# EAGLE schematic epapertagjig (EAGLE 9.6.2)

## Sheet 1 of 2
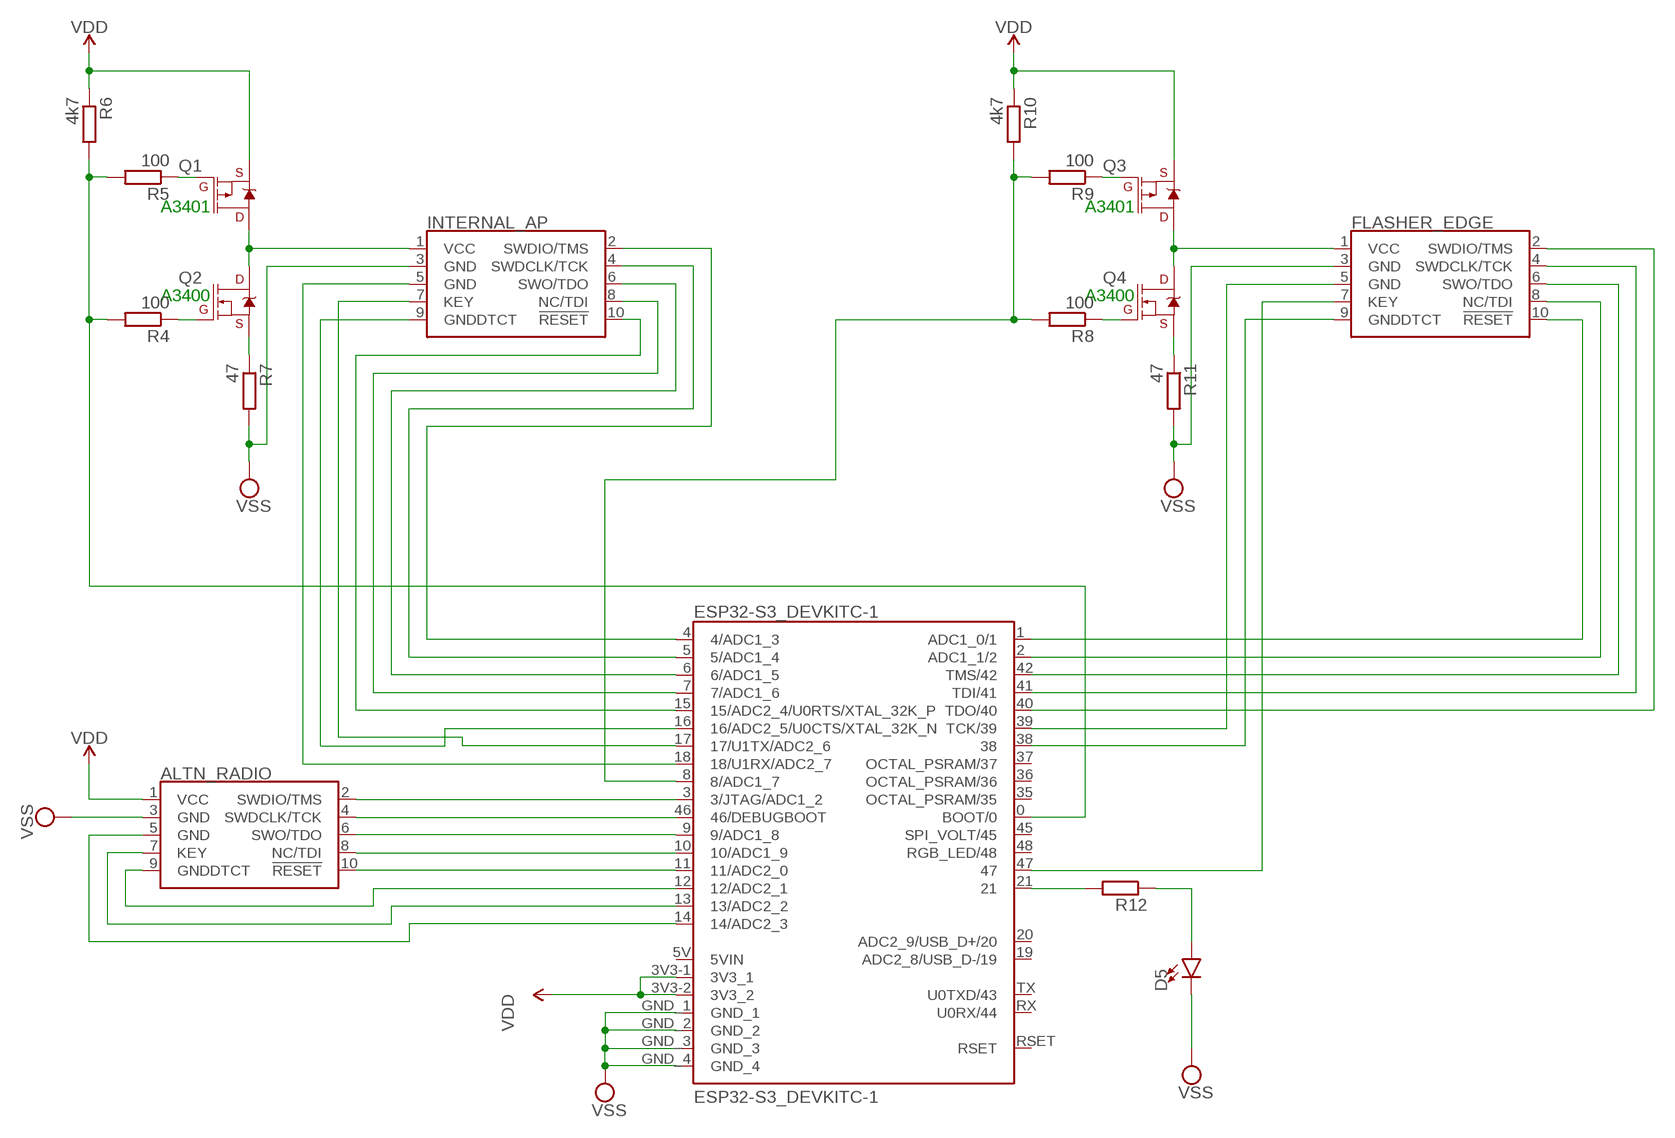
[diagram p0: schematic, sheet 1]

### Parts
ALTN_RADIO  JTAG  CORTEX_JTAG_DEBUG_SMD  [2X5-SMD-1.27MM]
D5  LED1206  [LED-1206]
FLASHER_EDGE  CORTEX_JTAG_DEBUG_PTH  [2X5-PTH-1.27MM]
INTERNAL_AP  JTAG  CORTEX_JTAG_DEBUG_SMD  [2X5-SMD-1.27MM]
J9  ESP32-S3_DEVKITC-1  [ESP32-S3_DEVKITC-1]
Q1  1.1A/60V/600mΩ  MOSFET_PCH-SI2309DS  [SOT23-3]
Q2  5.8A/30V/35mΩ  MOSFET-NCH-AO3404A  [SOT23-3]
Q3  1.1A/60V/600mΩ  MOSFET_PCH-SI2309DS  [SOT23-3]
Q4  5.8A/30V/35mΩ  MOSFET-NCH-AO3404A  [SOT23-3]
R4  100  R-EU_R1206  [R1206]
R5  100  R-EU_R1206  [R1206]
R6  4k7  R-EU_R1206  [R1206]
R7  47  R-EU_R1206  [R1206]
R8  100  R-EU_R1206  [R1206]
R9  100  R-EU_R1206  [R1206]
R10  4k7  R-EU_R1206  [R1206]
R11  47  R-EU_R1206  [R1206]
R12  R-EU_R1206  [R1206]

### Nets
N$39: INTERNAL_AP.1(VCC) Q1.3(D) Q2.3(D)
N$40: Q2.2(S) R7.1
N$41: J9.0(BOOT/0) R4.2 R5.2 R6.2
N$42: Q2.1(G) R4.1
N$43: Q1.1(G) R5.1
N$44: FLASHER_EDGE.1(VCC) Q3.3(D) Q4.3(D)
N$45: J9.8(8/ADC1_7) R8.2 R9.2 R10.2
N$46: Q4.1(G) R8.1
N$47: Q3.1(G) R9.1
N$48: Q4.2(S) R11.1
N$49: INTERNAL_AP.5(GND) J9.18(18/U1RX/ADC2_7)
N$50: INTERNAL_AP.9(GNDDTCT) J9.16(16/ADC2_5/U0CTS/XTAL_32K_N)
N$52: INTERNAL_AP.10(!RESET) J9.15(15/ADC2_4/U0RTS/XTAL_32K_P)
N$53: INTERNAL_AP.8(NC/TDI) J9.7(7/ADC1_6)
N$54: INTERNAL_AP.6(SWO/TDO) J9.6(6/ADC1_5)
N$55: INTERNAL_AP.4(SWDCLK/TCK) J9.5(5/ADC1_4)
N$56: INTERNAL_AP.2(SWDIO/TMS) J9.4(4/ADC1_3)
N$57: FLASHER_EDGE.6(SWO/TDO) J9.42(TMS/42)
N$58: FLASHER_EDGE.10(!RESET) J9.1(ADC1_0/1)
N$59: FLASHER_EDGE.8(NC/TDI) J9.2(ADC1_1/2)
N$60: FLASHER_EDGE.4(SWDCLK/TCK) J9.41(TDI/41)
N$61: FLASHER_EDGE.2(SWDIO/TMS) J9.40(TDO/40)
N$62: ALTN_RADIO.2(SWDIO/TMS) J9.3(3/JTAG/ADC1_2)
N$63: ALTN_RADIO.4(SWDCLK/TCK) J9.46(46/DEBUGBOOT)
N$64: ALTN_RADIO.6(SWO/TDO) J9.9(9/ADC1_8)
N$65: ALTN_RADIO.8(NC/TDI) J9.10(10/ADC1_9)
N$66: ALTN_RADIO.10(!RESET) J9.11(11/ADC2_0)
N$67: ALTN_RADIO.9(GNDDTCT) J9.12(12/ADC2_1)
N$68: ALTN_RADIO.7(KEY) J9.13(13/ADC2_2)
N$69: ALTN_RADIO.5(GND) J9.14(14/ADC2_3)
N$70: FLASHER_EDGE.5(GND) J9.39(TCK/39)
N$71: FLASHER_EDGE.9(GNDDTCT) J9.38
N$72: FLASHER_EDGE.7(KEY) J9.47
N$73: INTERNAL_AP.7(KEY) J9.17(17/U1TX/ADC2_6)
N$75: J9.21 R12.2
N$76: D5.A R12.1
VDD: ALTN_RADIO.1(VCC) J9.3V3-1(3V3_1) J9.3V3-2(3V3_2) Q1.2(S) Q3.2(S) R6.1 R10.1
VSS: ALTN_RADIO.3(GND) D5.C FLASHER_EDGE.3(GND) INTERNAL_AP.3(GND) J9.GND_1 J9.GND_2 J9.GND_3 J9.GND_4 R7.2 R11.2
Unconnected: J9.5V(5VIN) J9.19(ADC2_8/USB_D-/19) J9.20(ADC2_9/USB_D+/20) J9.35(OCTAL_PSRAM/35) J9.36(OCTAL_PSRAM/36) J9.37(OCTAL_PSRAM/37) J9.45(SPI_VOLT/45) J9.48(RGB_LED/48) J9.RSET J9.RX(U0RX/44) J9.TX(U0TXD/43)

### Notes on the sheet
- A3401 | A3401
- A3400 | A3400

## Sheet 2 of 2
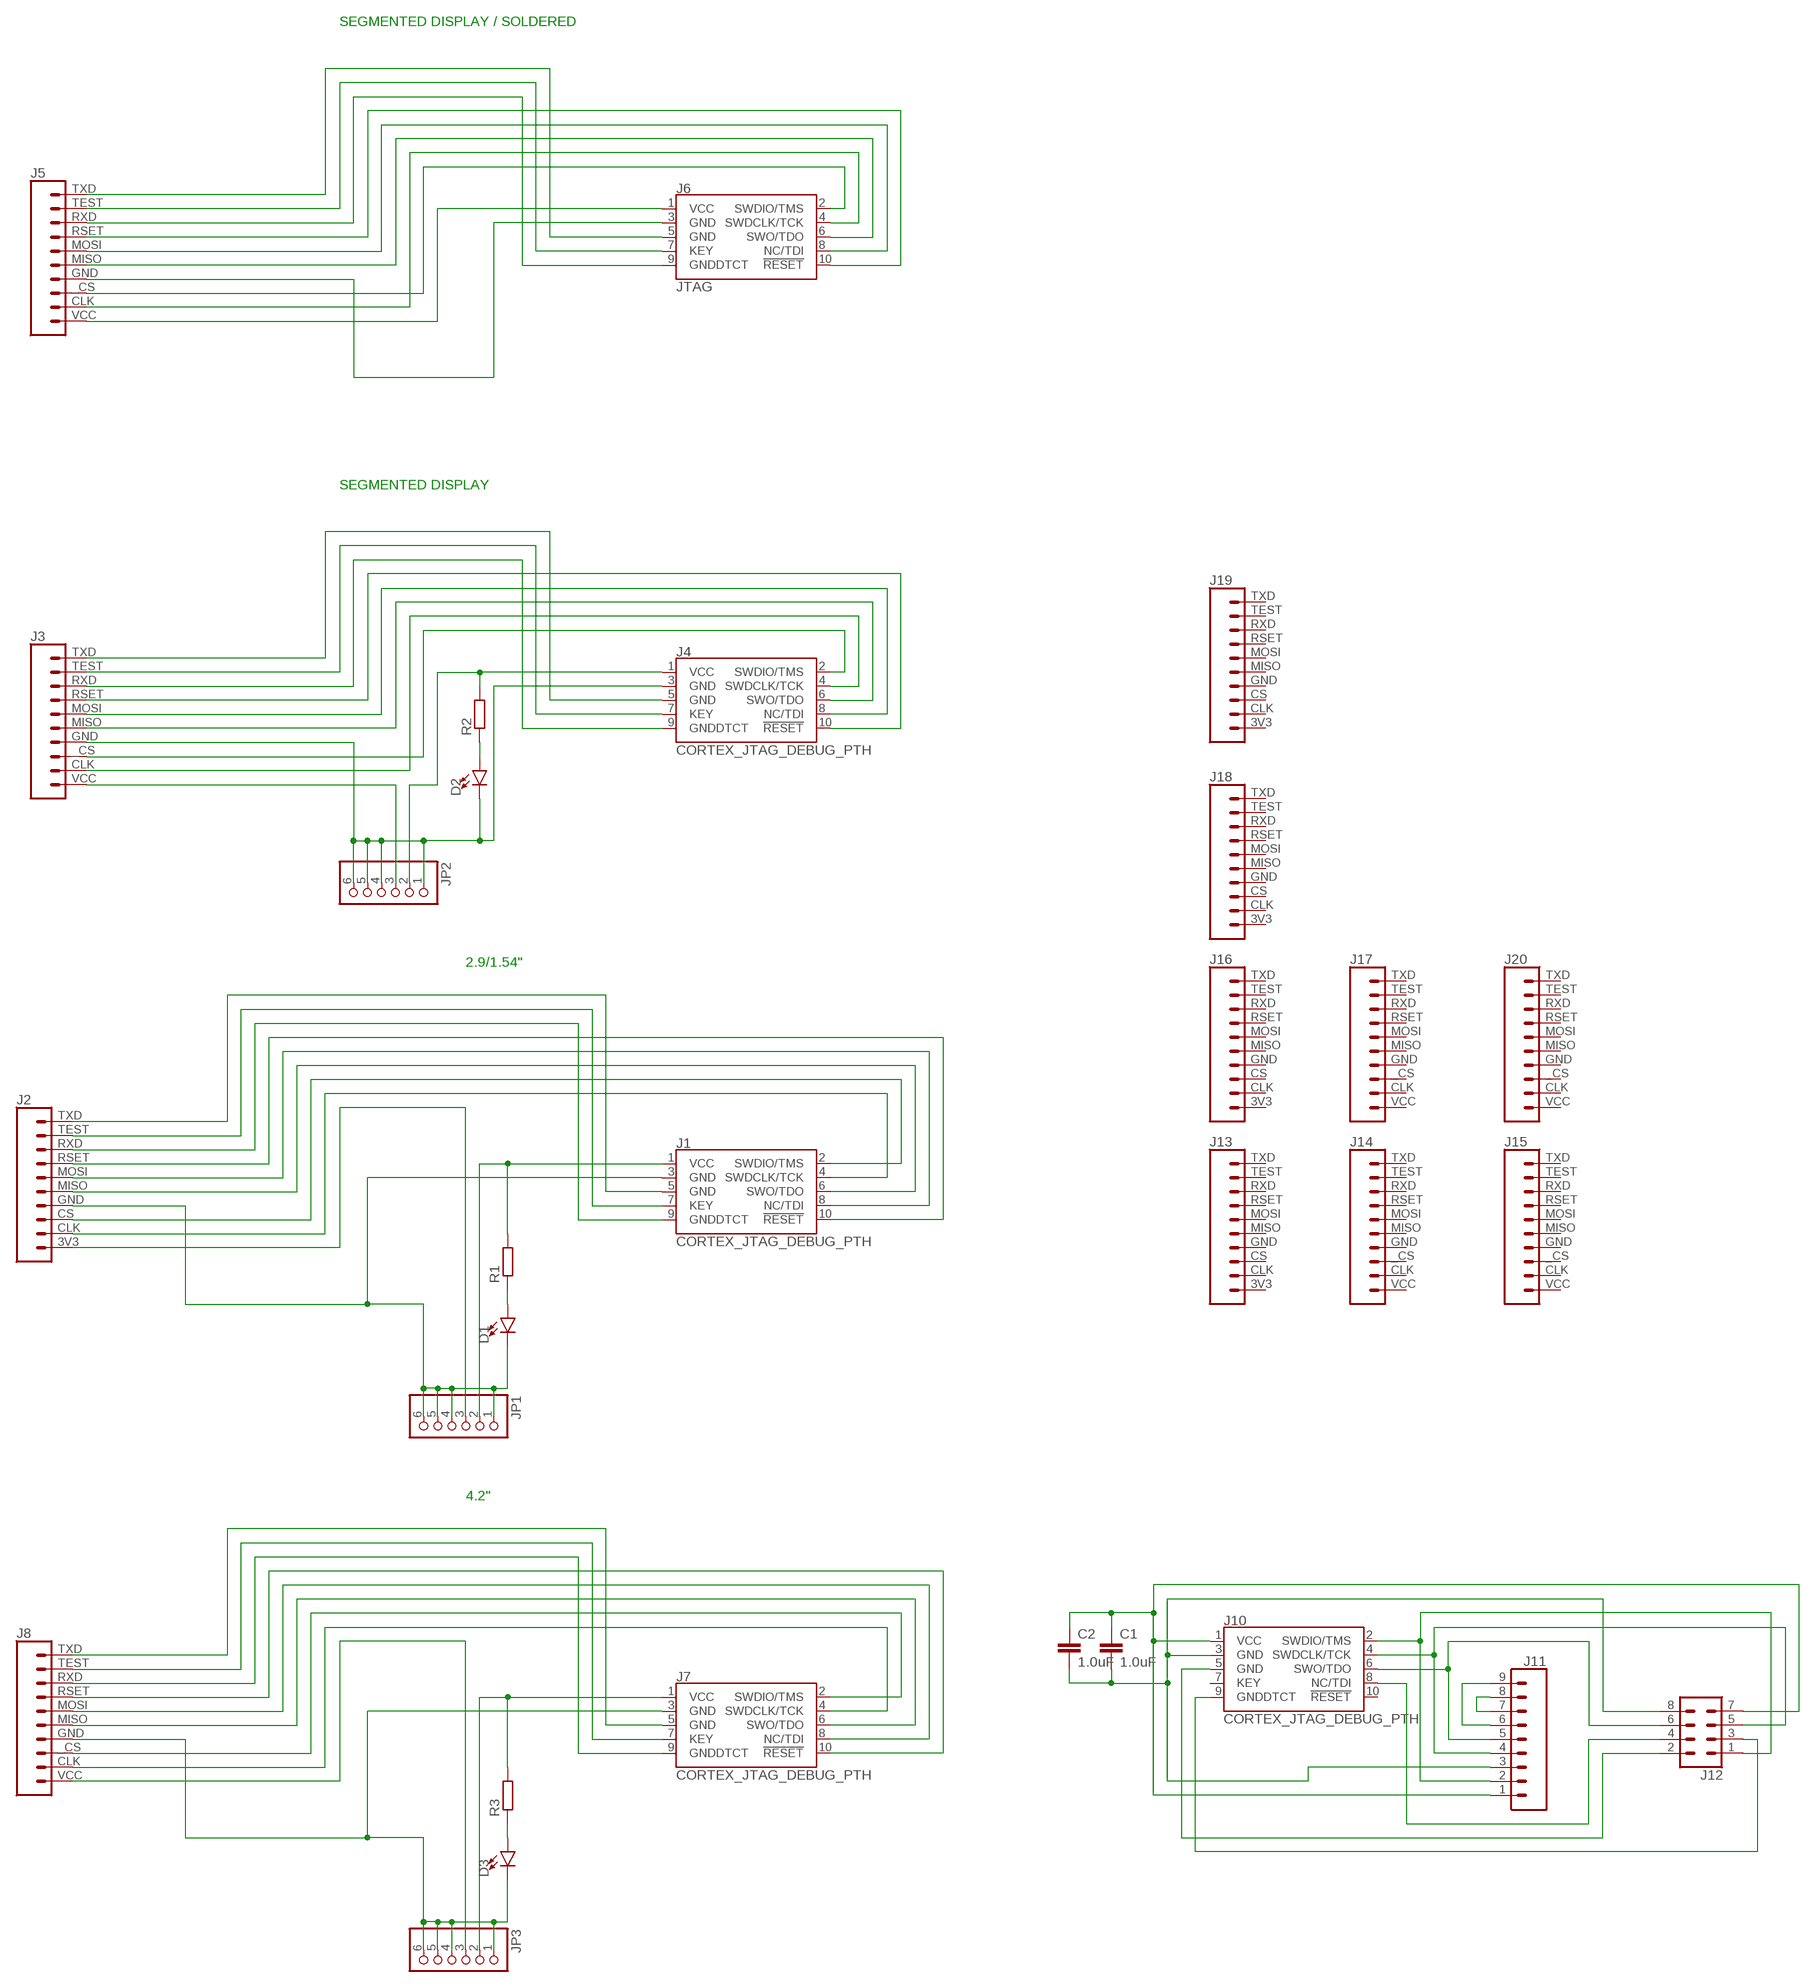
[diagram p1: schematic, sheet 2]

### Parts
C1  1.0uF  1.0UF-1206-50V-10%  [1206]
C2  1.0uF  1.0UF-1206-50V-10%  [1206]
D1  LED1206  [LED-1206]
D2  LED1206  [LED-1206]
D3  LED1206  [LED-1206]
J1  CORTEX_JTAG_DEBUG_PTH  [2X5-PTH-1.27MM]
J2  SOLUM_ZBS_DEBUG  [SOLUM_ZBS_DEBUG]
J3  SOLUM_ZBS_DEBUGSEGMENTED_DISPLAY  [SOLUM_ZBS_DEBUG_SEG]
J4  CORTEX_JTAG_DEBUG_PTH  [2X5-PTH-1.27MM]
J5  SOLUM_ZBS_DEBUGSEGMENTED_DISPLAY  [SOLUM_ZBS_DEBUG_SEG]
J6  JTAG  CORTEX_JTAG_DEBUG_SMD  [2X5-SMD-1.27MM]
J7  CORTEX_JTAG_DEBUG_PTH  [2X5-PTH-1.27MM]
J8  SOLUM_ZBS_DEBUGSOLUM_ZBS_DEBUG_4.2  [SOLUM_ZBS_DEBUG_4.2]
J10  CORTEX_JTAG_DEBUG_PTH  [2X5-PTH-1.27MM]
J11  CONN_09  [1X09]
J12  CONN_04X2  [2X4]
J13  SOLUM_ZBS_DEBUG  [SOLUM_ZBS_DEBUG]
J14  SOLUM_ZBS_DEBUGSEGMENTED_DISPLAY  [SOLUM_ZBS_DEBUG_SEG]
J15  SOLUM_ZBS_DEBUGSOLUM_ZBS_DEBUG_4.2  [SOLUM_ZBS_DEBUG_4.2]
J16  SOLUM_ZBS_DEBUG  [SOLUM_ZBS_DEBUG]
J17  SOLUM_ZBS_DEBUGSEGMENTED_DISPLAY  [SOLUM_ZBS_DEBUG_SEG]
J18  SOLUM_ZBS_DEBUG  [SOLUM_ZBS_DEBUG]
J19  SOLUM_ZBS_DEBUG  [SOLUM_ZBS_DEBUG]
J20  SOLUM_ZBS_DEBUGSOLUM_ZBS_DEBUG_4.2  [SOLUM_ZBS_DEBUG_4.2]
JP1  PINHD-1X6/90  [1X06/90]
JP2  PINHD-1X6/90  [1X06/90]
JP3  PINHD-1X6/90  [1X06/90]
R1  R-EU_R1206  [R1206]
R2  R-EU_R1206  [R1206]
R3  R-EU_R1206  [R1206]

### Nets
3V1: J8.VCC JP3.3
3V3: J2.3V3 JP1.3
GND: D1.C J1.3(GND) J2.GND JP1.1 JP1.4 JP1.5 JP1.6
GND1: J5.GND J6.3(GND)
GND2: D2.C J3.GND J4.3(GND) JP2.1 JP2.4 JP2.5 JP2.6
GND3: D3.C J7.3(GND) J8.GND JP3.1 JP3.4 JP3.5 JP3.6
N$1: D2.A R2.1
N$2: D1.A R1.1
N$3: D3.A R3.1
N$4: J4.1(VCC) JP2.2 R2.2
N$5: J1.4(SWDCLK/TCK) J2.CLK
N$6: J1.2(SWDIO/TMS) J2.CS
N$7: J1.6(SWO/TDO) J2.MISO
N$8: J3._CS J4.2(SWDIO/TMS)
N$9: J1.8(NC/TDI) J2.MOSI
N$10: J1.10(!RESET) J2.RSET
N$11: J1.9(GNDDTCT) J2.RXD
N$12: J1.7(KEY) J2.TEST
N$13: J1.5(GND) J2.TXD
N$14: J3.CLK J4.4(SWDCLK/TCK)
N$15: J3.MISO J4.6(SWO/TDO)
N$16: J3.MOSI J4.8(NC/TDI)
N$17: J3.RSET J4.10(!RESET)
N$18: J3.VCC JP2.3
N$19: J3.RXD J4.9(GNDDTCT)
N$20: J3.TEST J4.7(KEY)
N$21: J3.TXD J4.5(GND)
N$22: J7.4(SWDCLK/TCK) J8.CLK
N$23: J5._CS J6.2(SWDIO/TMS)
N$24: J5.CLK J6.4(SWDCLK/TCK)
N$25: J5.MISO J6.6(SWO/TDO)
N$26: J5.MOSI J6.8(NC/TDI)
N$27: J5.RSET J6.10(!RESET)
N$28: J5.VCC J6.1(VCC)
N$29: J5.RXD J6.9(GNDDTCT)
N$30: J5.TEST J6.7(KEY)
N$31: J5.TXD J6.5(GND)
N$32: J7.2(SWDIO/TMS) J8._CS
N$33: J7.6(SWO/TDO) J8.MISO
N$34: J7.8(NC/TDI) J8.MOSI
N$35: J7.10(!RESET) J8.RSET
N$36: J7.9(GNDDTCT) J8.RXD
N$37: J7.7(KEY) J8.TEST
N$38: J7.5(GND) J8.TXD
N$77: C1.1 C2.1 J10.1(VCC) J11.1 J12.7
N$78: J11.7 J11.8
N$79: C1.2 C2.2 J10.3(GND) J11.3 J12.8
N$80: J11.6 J11.9
N$81: J10.6(SWO/TDO) J11.5 J12.6
N$82: J10.4(SWDCLK/TCK) J11.4 J12.5
N$83: J10.2(SWDIO/TMS) J11.2 J12.1
N$84: J10.8(NC/TDI) J12.4
N$86: J10.5(GND) J12.2
N$87: J10.9(GNDDTCT) J12.3
V_IN: J1.1(VCC) JP1.2 R1.2
V_IN1: J7.1(VCC) JP3.2 R3.2
Unconnected: J10.7(KEY) J10.10(!RESET) J13.3V3 J13.CLK J13.CS J13.GND J13.MISO J13.MOSI J13.RSET J13.RXD J13.TEST J13.TXD J14._CS J14.CLK J14.GND J14.MISO J14.MOSI J14.RSET J14.RXD J14.TEST J14.TXD J14.VCC J15._CS J15.CLK J15.GND J15.MISO J15.MOSI J15.RSET J15.RXD J15.TEST J15.TXD J15.VCC J16.3V3 J16.CLK J16.CS J16.GND J16.MISO J16.MOSI J16.RSET J16.RXD J16.TEST J16.TXD J17._CS J17.CLK J17.GND J17.MISO J17.MOSI J17.RSET J17.RXD J17.TEST J17.TXD J17.VCC J18.3V3 J18.CLK J18.CS J18.GND J18.MISO J18.MOSI J18.RSET J18.RXD J18.TEST J18.TXD J19.3V3 J19.CLK J19.CS J19.GND J19.MISO J19.MOSI J19.RSET J19.RXD J19.TEST J19.TXD J20._CS J20.CLK J20.GND J20.MISO J20.MOSI J20.RSET J20.RXD J20.TEST J20.TXD J20.VCC

### Notes on the sheet
- SEGMENTED DISPLAY / SOLDERED
- SEGMENTED DISPLAY
- 2.9/1.54"
- 4.2"

## Library data of the parts
ALTN_RADIO INTERNAL_AP J6 = SparkFun-Connectors:CORTEX_JTAG_DEBUG: Cortex Debug Connector - 10 pin Supports JTAG debug, Serial Wire debug, and Serial Wire Viewer. PTH and SMD connector options available. General Connector Information <http://infocenter.arm.com/help/topic/com.arm.doc.faqs/attached/13634/cortex_debug_connectors.pdf> Products: PTH Connector <http://www.digikey.com/product-detail/en/cnc-tech/3220-10-0100-00/1175-1627-ND/3883661> -via Digi-Key SparkFun PSoc <https://www.sparkfun.com/products/13229> SparkFun T <https://www.sparkfun.com/products/13810>; PROD_ID: CONN-14503
C1 C2 = SparkFun-Capacitors:1.0UF: 1µF ceramic capacitors A capacitor is a passive two-terminal electrical component used to store electrical energy temporarily in an electric field.; PROD_ID: CAP-09822
D1-D3 D5 = SparkFun-LED:LED: LED (Generic) Standard schematic elements and footprints for 5mm, 3mm, 1206, and 0603 sized LEDs. Generic LEDs with no color specified.
FLASHER_EDGE J1 J4 J7 J10 = SparkFun-Connectors:CORTEX_JTAG_DEBUG: Cortex Debug Connector - 10 pin Supports JTAG debug, Serial Wire debug, and Serial Wire Viewer. PTH and SMD connector options available. General Connector Information <http://infocenter.arm.com/help/topic/com.arm.doc.faqs/attached/13634/cortex_debug_connectors.pdf> Products: PTH Connector <http://www.digikey.com/product-detail/en/cnc-tech/3220-10-0100-00/1175-1627-ND/3883661> -via Digi-Key SparkFun PSoc <https://www.sparkfun.com/products/13229> SparkFun T <https://www.sparkfun.com/products/13810>
J2 J3 J5 J8 J13-J20 = SparkFun-Connectors:SOLUM_ZBS_DEBUG: Multi connection point. Often used as Generic Header-pin footprint for 0.1 inch spaced/style header connections On any of the 0.1 inch spaced packages, you can populate with these: Break Away Headers - Straight <https://www.sparkfun.com/products/116> (PRT-00116) Break Away Male Headers - Right Angle <https://www.sparkfun.com/products/553> (PRT-00553) Female Headers <https://www.sparkfun.com/products/115> (PRT-00115) Break Away Headers - Machine Pin <https://www.sparkfun.com/products/117> (PRT-00117) Break Away Female Headers - Swiss Machine Pin <https://www.sparkfun.com/products/743> (PRT-00743) Arduino Stackable Header - 10 Pin <https://www.sparkfun.com/products/11376> (PRT-11376) For SCREWTERMINALS and SPRING TERMINALS visit here: Screw Terimnals on SparkFun.com <https://www.sparkfun.com/search/results?term=Screw+Terminals> (5mm/3.5mm/2.54mm spacing) This device is also useful as a general connection point to wire up your design to another part of your project. Our various solder wires solder well into these plated through hole pads. Hook-Up Wire - Assortment (Stranded, 22 AWG) <https://www.sparkfun.com/products/11375> (PRT-11375) Hook-Up Wire - Assortment (Solid Core, 22 AWG) <https://www.sparkfun.com/products/11367> (PRT-11367) View the entire wire category on our website here <https://www.sparkfun.com/categories/141> Special notes: Molex polarized connector foot print use with SKU : PRT-08231 with associated crimp pins and housings. 1MM SMD Version SKU: PRT-10208 NOTES ON THE VARIANTS LOCK and LOCK_LONGPADS... This footprint was designed to help hold the alignment of a through-hole component (i.e. 6-pin header) while soldering it into place. You may notice that each hole has been shifted either up or down by 0.005 of an inch from it's more standard position (which is a perfectly straight line). This slight alteration caused the pins (the squares in the middle) to touch the edges of the holes. Because they are alternating, it causes a "brace" to hold the component in place. 0.005 has proven to be the perfect amount of "off-center" position when using our standard breakaway headers. Although looks a little odd when you look at the bare footprint, once you have a header in there, the alteration is very hard to notice. Also,if you push a header all the way into place, it is covered up entirely on the bottom side.
J9 = SparkFun-Connectors:ESP32-S3_DEVKITC-1: ATX24 Pin Power Supply Connector - Right Angle PTH Mount This is a good connector for connecting a computer power supply to a PCB. It's massive, but provides many amps of power at 5V and 12V. SparkFun Products: SparkFun Benchtop Power Board Kit <https://www.sparkfun.com/products/12867> SparkFun Power Driver Shield Kit <https://www.sparkfun.com/products/10618>
J11 = SparkFun-Connectors:CONN_09: Multi connection point. Often used as Generic Header-pin footprint for 0.1 inch spaced/style header connections On any of the 0.1 inch spaced packages, you can populate with these: Break Away Headers - Straight <https://www.sparkfun.com/products/116> (PRT-00116) Break Away Male Headers - Right Angle <https://www.sparkfun.com/products/553> (PRT-00553) Female Headers <https://www.sparkfun.com/products/115> (PRT-00115) Break Away Headers - Machine Pin <https://www.sparkfun.com/products/117> (PRT-00117) Break Away Female Headers - Swiss Machine Pin <https://www.sparkfun.com/products/743> (PRT-00743) For SCREWTERMINALS and SPRING TERMINALS visit here: Screw Terimnals on SparkFun.com <https://www.sparkfun.com/search/results?term=Screw+Terminals> (5mm/3.5mm/2.54mm spacing) This device is also useful as a general connection point to wire up your design to another part of your project. Our various solder wires solder well into these plated through hole pads. Hook-Up Wire - Assortment (Stranded, 22 AWG) <https://www.sparkfun.com/products/11375> (PRT-11375) Hook-Up Wire - Assortment (Solid Core, 22 AWG) <https://www.sparkfun.com/products/11367> (PRT-11367) View the entire wire category on our website here <https://www.sparkfun.com/categories/141> Special notes: Molex polarized connector foot print use with SKU : PRT-08231 with associated crimp pins and housings. 1MM SMD Version SKU: PRT-10208 NOTES ON THE VARIANTS LOCK and LOCK_LONGPADS... This footprint was designed to help hold the alignment of a through-hole component (i.e. 6-pin header) while soldering it into place. You may notice that each hole has been shifted either up or down by 0.005 of an inch from it's more standard position (which is a perfectly straight line). This slight alteration caused the pins (the squares in the middle) to touch the edges of the holes. Because they are alternating, it causes a "brace" to hold the component in place. 0.005 has proven to be the perfect amount of "off-center" position when using our standard breakaway headers. Although looks a little odd when you look at the bare footprint, once you have a header in there, the alteration is very hard to notice. Also,if you push a header all the way into place, it is covered up entirely on the bottom side.
J12 = SparkFun-Connectors:CONN_04X2: Multi connection point. Often used as Generic Header-pin footprint for 0.1 inch spaced/style header connections On any of the 0.1 inch spaced packages, you can populate with these: Break Away Headers - Straight <https://www.sparkfun.com/products/116> (PRT-00116) Break Away Male Headers - Right Angle <https://www.sparkfun.com/products/553> (PRT-00553) Female Headers <https://www.sparkfun.com/products/115> (PRT-00115) Break Away Headers - Machine Pin <https://www.sparkfun.com/products/117> (PRT-00117) Break Away Female Headers - Swiss Machine Pin <https://www.sparkfun.com/products/743> (PRT-00743)
JP1-JP3 = pinhead:PINHD-1X6: PIN HEADER
Q1 Q3 = SparkFun-DiscreteSemi:MOSFET_PCH: P-channel MOSFETs Voltage controlled devices that allow control of high current outputs. SparkFun Products: SparkFun ESP32 Thing <https://www.sparkfun.com/products/13907> SparkFun ESP8266 Thing <https://www.sparkfun.com/products/13231> SparkFun Pi Servo HAT V2 <https://www.sparkfun.com/products/15316> DMG2305UX-7 (20V/4.2A/SOT23-3); PROD_ID: TRANS-08285
Q2 Q4 = SparkFun-DiscreteSemi:MOSFET-NCH: N-channel MOSFETs Voltage controlled devices that allow control of high current outputs. SparkFun Products: SparkFun OpenScale <https://www.sparkfun.com/products/13261> SparkFun Digital Sandbox <https://www.sparkfun.com/products/12651> SparkFun Monster Moto Shield <https://www.sparkfun.com/products/10182> SparkFun MOSFET Power Controller <https://www.sparkfun.com/products/11214>; PROD_ID: TRANS-12988
R1-R12 = rcl:R-EU_: RESISTOR, European symbol; SPICEPREFIX: R

## Net classes
0 default: width 0.203 mm